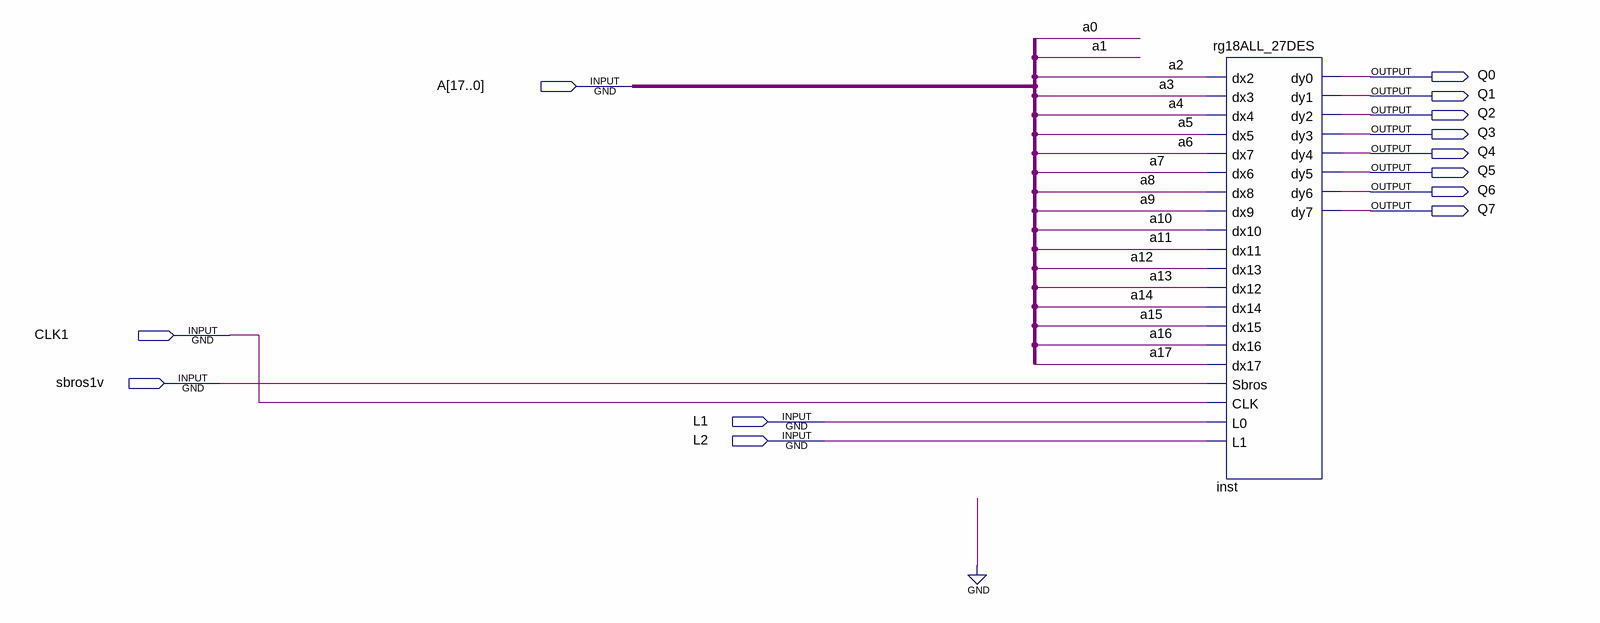
[diagram p0: schematic sheet]
// Quartus schematic rgandsum27des.bdf as structural Verilog: 1 symbols, 13 pins
module rgandsum27des (
  input  [17:0] A,
  input  CLK1,
  input  sbros1v,
  input  L1,
  input  L2,
  output Q0,
  output Q1,
  output Q2,
  output Q3,
  output Q4,
  output Q5,
  output Q6,
  output Q7
);

  rg18ALL_27DES inst (
    .dx2(A[2]), .dx3(A[3]), .dx4(A[4]), .dx5(A[5]), .dx7(A[6]), .dx6(A[7]), .dx8(A[8]), .dx9(A[9]),
    .dx10(A[10]), .dx11(A[11]), .dx13(A[12]), .dx12(A[13]), .dx14(A[14]), .dx15(A[15]), .dx16(A[16]),
    .dx17(A[17]), .Sbros(sbros1v), .CLK(CLK1), .L0(L1), .L1(L2), .dy0(Q0), .dy1(Q1), .dy2(Q2), .dy3(Q3),
    .dy4(Q4), .dy5(Q5), .dy6(Q6), .dy7(Q7));
endmodule
